# EAGLE design CAN Bus Breakout V1.0 (EAGLE 7.5.0)
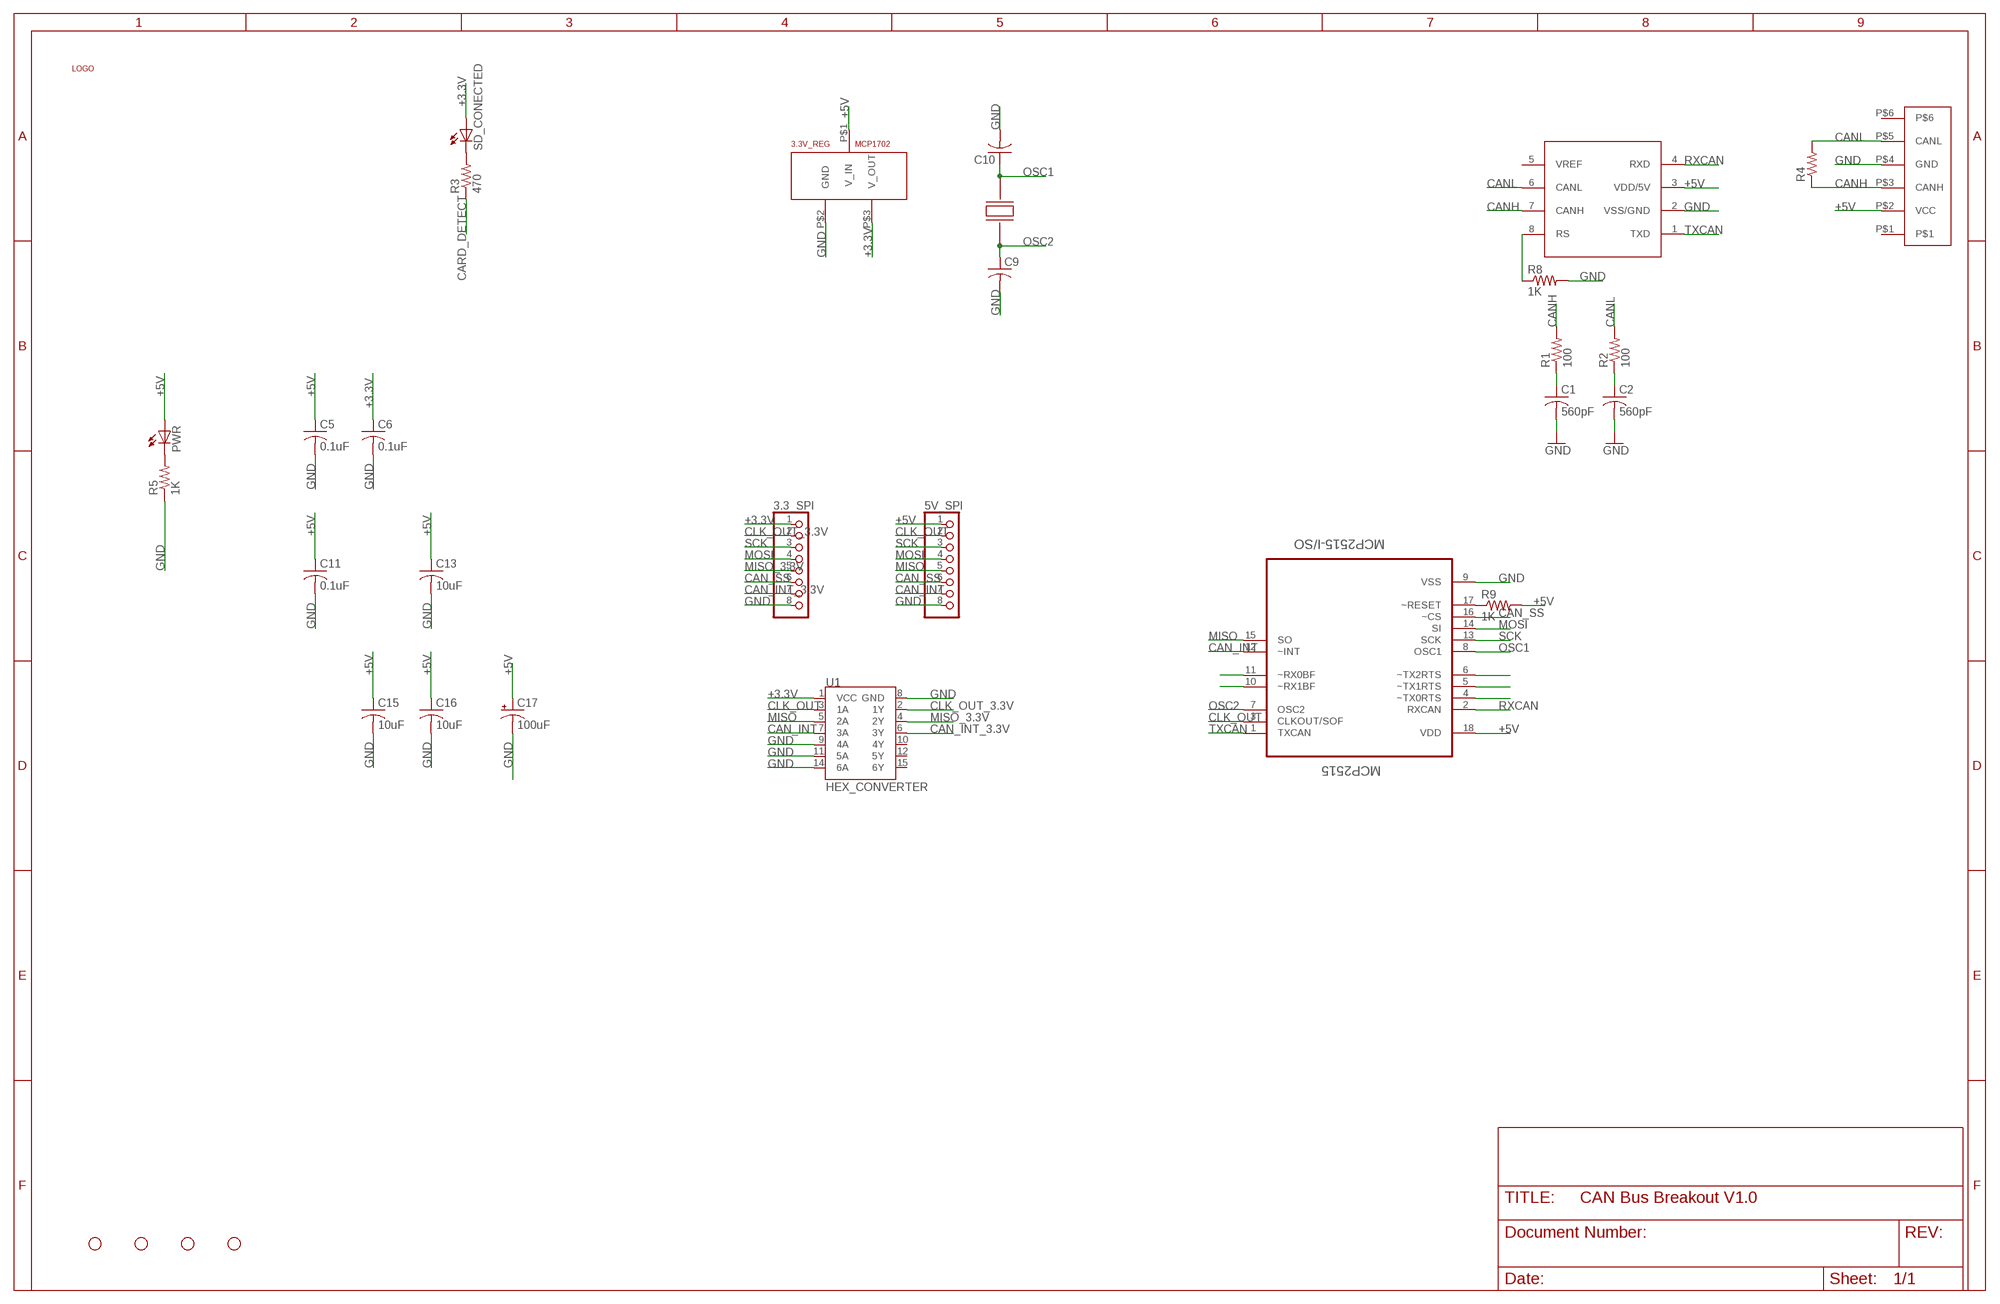
[diagram p0: schematic, sheet 1]

## Parts
3.3_SPI  PINHD-1X8CLEANBIG  [1X08-CLEANBIG]
3.3V_REG  MCP1702  [SOT-23A]
5V_SPI  PINHD-1X8CLEANBIG  [1X08-CLEANBIG]
C1  560pF  C-USC0805  [C0805]
C2  560pF  C-USC0805  [C0805]
C5  0.1uF  C-USC0805  [C0805]
C6  0.1uF  C-USC0805  [C0805]
C9  C-USC0805  [C0805]
C10  C-USC0805  [C0805]
C11  0.1uF  C-USC0805  [C0805]
C13  10uF  C-USC0805  [C0805]
C15  10uF  C-USC0805  [C0805]
C16  10uF  C-USC0805  [C0805]
C17  100uF  47UF-50V-20%(ELECT)  [PANASONIC_D]
MCP2515  MCP2515-I/SO  [SOIC127P1034X264-18N]
PWR  LED1206  [LED-1206]
R1  100  R-US_M0805  [M0805]
R2  100  R-US_M0805  [M0805]
R3  470  R-US_M0805  [M0805]
R4  R-US_M0805  [M0805]
R5  1K  R-US_M0805  [M0805]
R8  1K  R-US_M0805  [M0805]
R9  1K  R-US_M0805  [M0805]
SD_CONECTED  LED1206  [LED-1206]
STANDOFF1  STAND-OFF  [STAND-OFF]
STANDOFF2  STAND-OFF  [STAND-OFF]
STANDOFF3  STAND-OFF  [STAND-OFF]
STANDOFF4  STAND-OFF  [STAND-OFF]
U1  HEX_CONVERTER  [SO016]
U$1  CAN_6P6C  [CAN_6P6C]
U$2  MCP2551DIP  [DIP8]
U$3  LOGO  [LOGO]
U$19  CRYSTAL  [7A_CRYSTAL]

## Nets
+3.3V: 3.3_SPI.1 3.3V_REG.P$3(V_OUT) C6.1 SD_CONECTED.A U1.1(VCC)
+5V: 3.3V_REG.P$1(V_IN) 5V_SPI.1 C5.1 C11.1 C13.1 C15.1 C16.1 C17.+ MCP2515.18(VDD) PWR.A R9.2 U$1.P$2(VCC) U$2.3(VDD/5V)
CAN_INT: 5V_SPI.7 MCP2515.12(~INT) U1.7(3A)
CAN_INT_3.3V: 3.3_SPI.7 U1.6(3Y)
CAN_SS: 3.3_SPI.6 5V_SPI.6 MCP2515.16(~CS)
CANH: R1.2 R4.1 U$1.P$3(CANH) U$2.7(CANH)
CANL: R2.2 R4.2 U$1.P$5(CANL) U$2.6(CANL)
CARD_DETECT: R3.1
CLK_OUT: 5V_SPI.2 MCP2515.3(CLKOUT/SOF) U1.3(1A)
CLK_OUT_3.3V: 3.3_SPI.2 U1.2(1Y)
GND: 3.3_SPI.8 3.3V_REG.P$2(GND) 5V_SPI.8 C1.2 C2.2 C5.2 C6.2 C9.2 C10.2 C11.2 C13.2 C15.2 C16.2 C17.- MCP2515.9(VSS) R5.1 R8.2 U1.8(GND) U1.9(4A) U1.11(5A) U1.14(6A) U$1.P$4(GND) U$2.2(VSS/GND)
MISO: 5V_SPI.5 MCP2515.15(SO) U1.5(2A)
MISO_3.3V: 3.3_SPI.5 U1.4(2Y)
MOSI: 3.3_SPI.4 5V_SPI.4 MCP2515.14(SI)
N$1: MCP2515.4(~TX0RTS)
N$2: MCP2515.5(~TX1RTS)
N$3: MCP2515.6(~TX2RTS)
N$4: MCP2515.11(~RX0BF)
N$7: R3.2 SD_CONECTED.C
N$12: R8.1 U$2.8(RS)
N$15: MCP2515.17(~RESET) R9.1
N$19: PWR.C R5.2
N$24: MCP2515.10(~RX1BF)
N$25: C1.1 R1.1
N$26: C2.1 R2.1
OSC1: C10.1 MCP2515.8(OSC1) U$19.P$2
OSC2: C9.1 MCP2515.7(OSC2) U$19.P$1
RXCAN: MCP2515.2(RXCAN) U$2.4(RXD)
SCK: 3.3_SPI.3 5V_SPI.3 MCP2515.13(SCK)
TXCAN: MCP2515.1(TXCAN) U$2.1(TXD)
Unconnected: U1.10(4Y) U1.12(5Y) U1.15(6Y) U$1.P$1 U$1.P$6 U$2.5(VREF)

## Library data of the parts
3.3_SPI 5V_SPI = adafruit:PINHD-1X8: PIN HEADER
3.3V_REG = mylibrary:MCP1702
C1 C2 C5 C6 C9-C11 C13 C15 C16 = adafruit:C-US: CAPACITOR, American symbol
C17 = SparkFun-Capacitors:47UF-50V-20%(ELECT): CAP-10547; PROD_ID: CAP-10547
MCP2515 = Microchip_By_element14_Batch_1:MCP2515-I/SO: CAN Controller; MPN: MCP2515-I/SO; OC_FARNELL: 1292239; OC_NEWARK: 29H7136; PACKAGE: SOIC-18; SUPPLIER: Microchip
PWR SD_CONECTED = Shell2013:LED: LEDs Standard schematic elements and footprints for 5mm, 3mm, 1206, and 0603 sized LEDs. 5mm - Spark Fun Electronics SKU : COM-00529 (and others)
R1-R5 R8 R9 = adafruit:R-US_: RESISTOR, American symbol
STANDOFF1-STANDOFF4 = SparkFun-Electromechanical:STAND-OFF: #4 Stand Off This is the mechanical footprint for a #4 phillips button head screw. Use the keepout ring to avoid running the screw head into surrounding components. SKU : PRT-00447
U1 = SparkFun-DigitalIC:HEX_CONVERTER: 74HC4050 Hex Buffer Level Shifter SMD SO016; PROD_ID: IC-09604
U$1 = Shell2013:CAN_6P6C: Digikey part: 553-2258-ND
U$2 = E-P-099-R2.2:MCP2551
U$3 = Shell2015:LOGO
U$19 = mylibrary:CRYSTAL

## Board
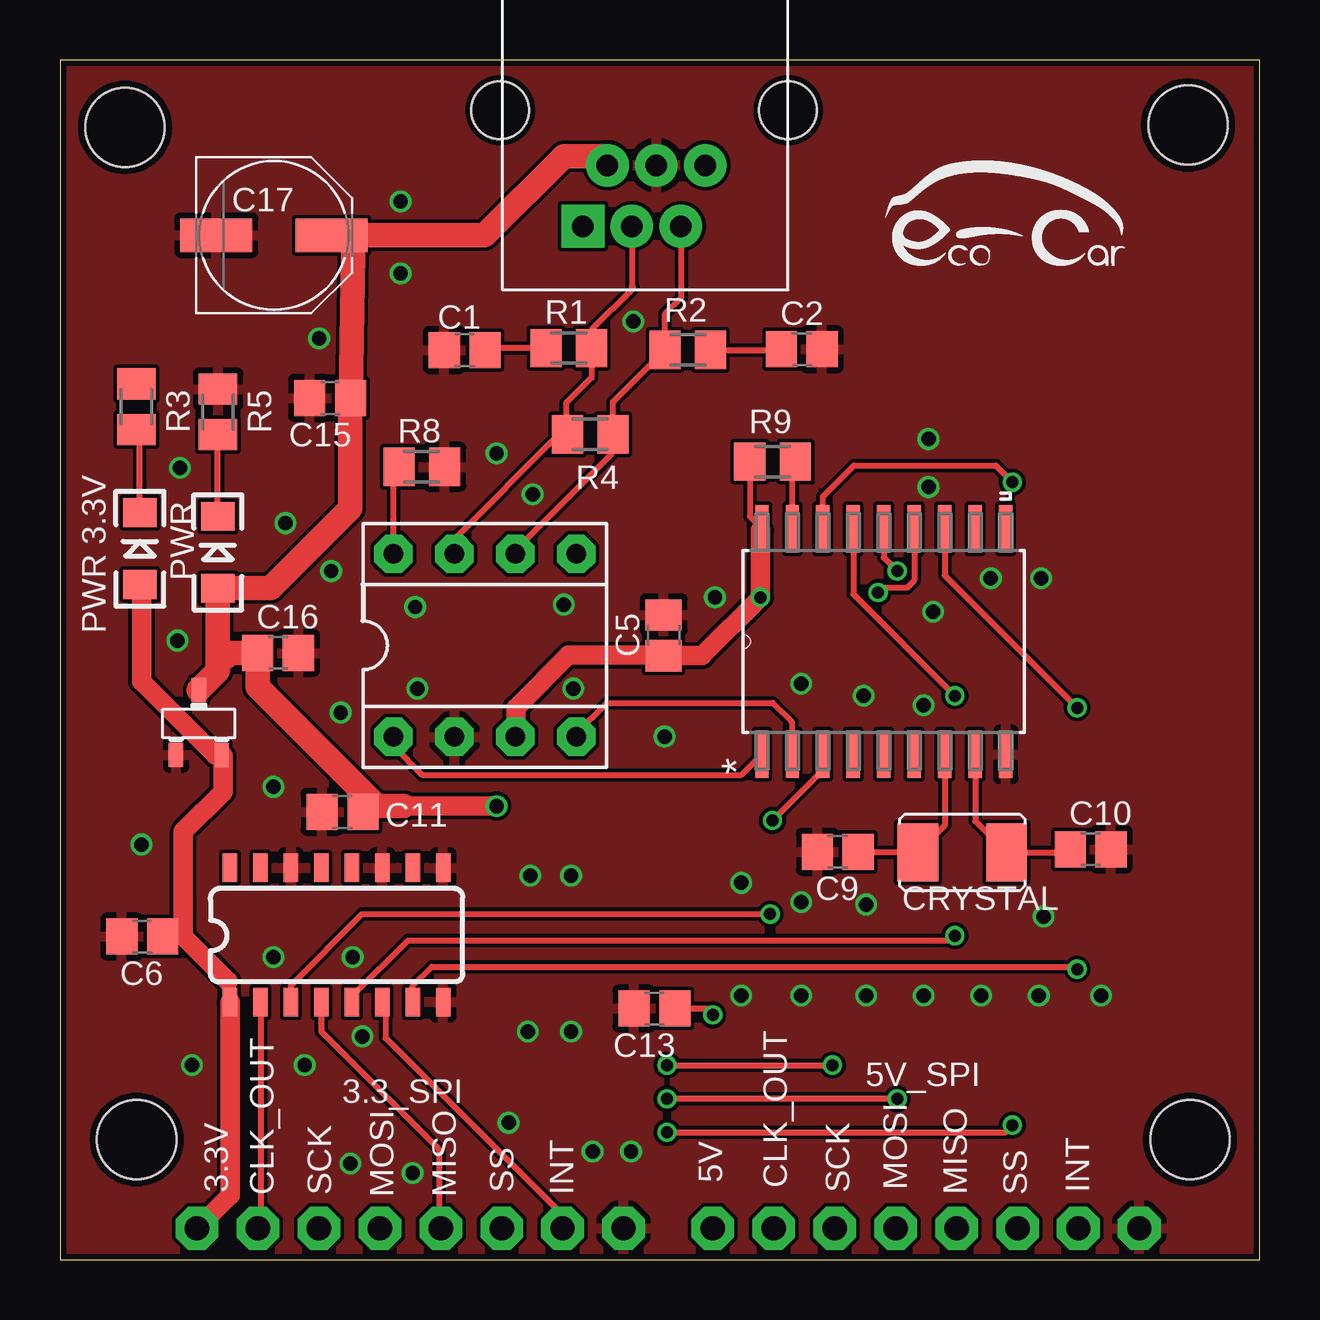
[diagram p1: board, top side]
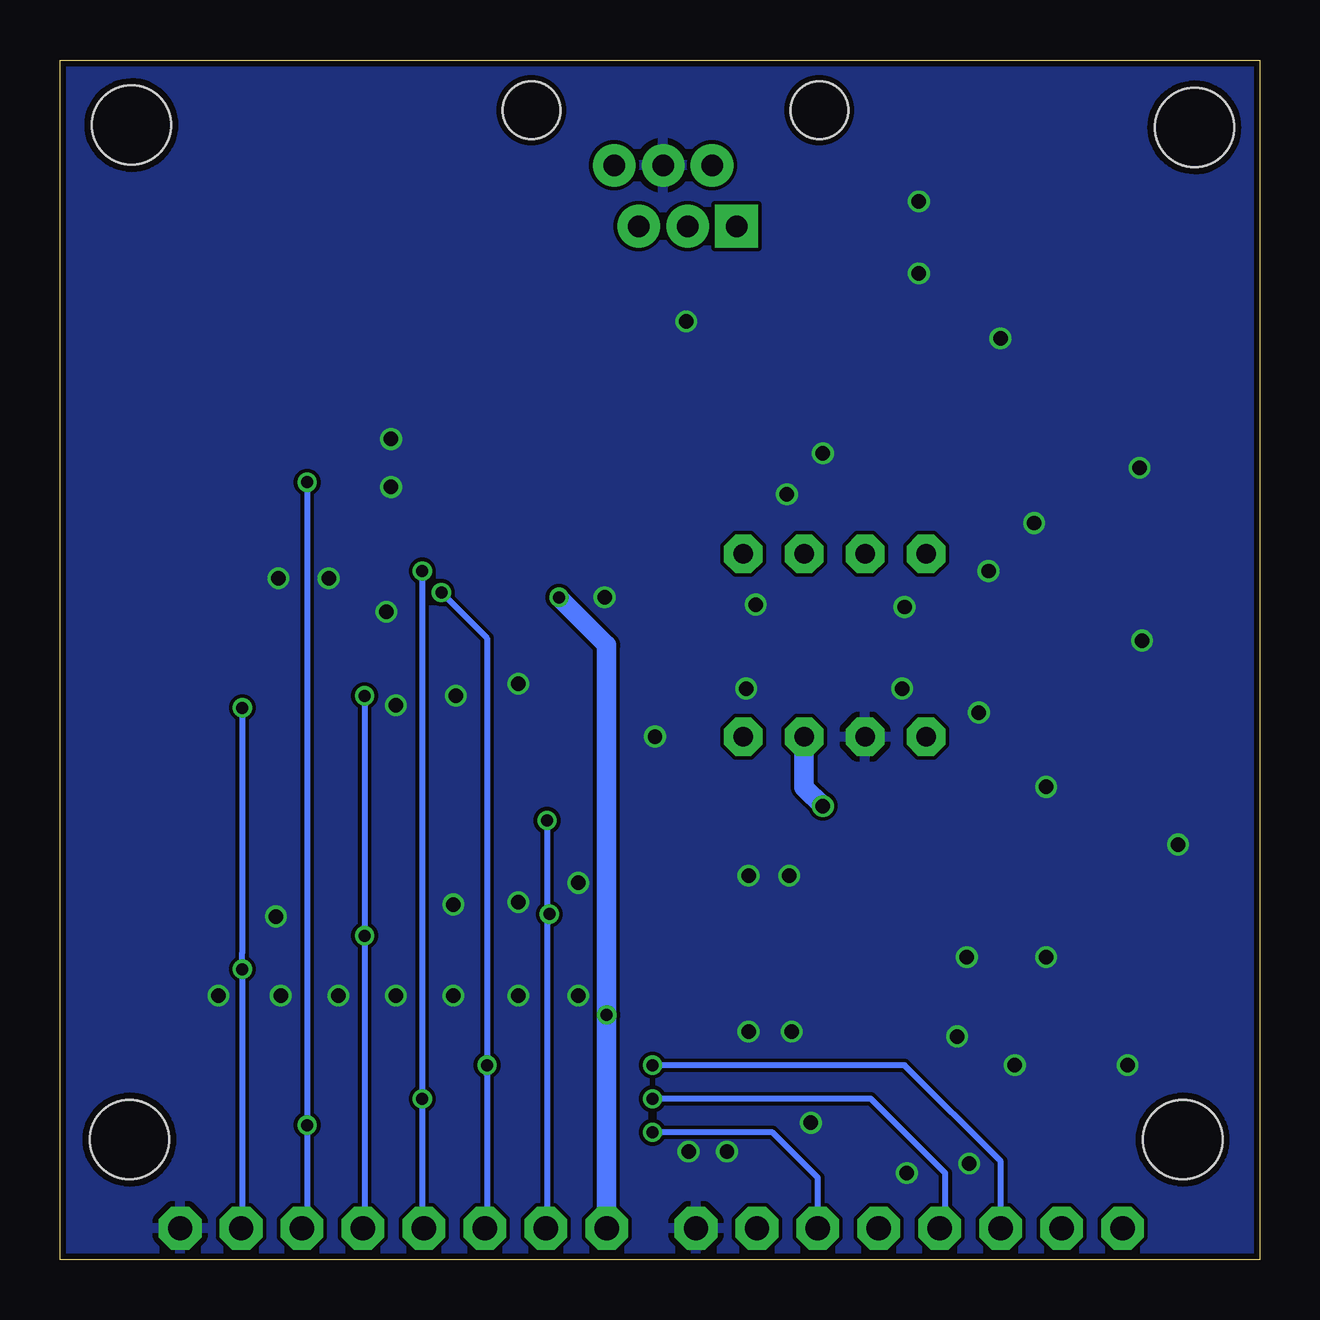
[diagram p2: board, bottom side, seen from below]

Size 50 x 50 mm. Coordinates in mm from the lower left corner, seen from the top.
Outline: 0,0 50,0 50,50 0,50 0,0
Copper layers (1*16): Top 0.035mm / dielectric 1.5mm / Bottom 0.035mm
Design rules "SeeedStudio_2layer_DRU_no_angle_20140221": minimum track width 6mil, minimum drill 12mil, track to track 6mil, track to pad 6mil, pad to pad 6mil, via to via 6mil, smd to smd 0mil, copper to edge 10mil, drill to drill 10mil, minimum pad ring 10mil, minimum via ring 6mil, stop-mask expansion 2mil, vias tented up to drill 100mil, thermal gap 10mil

### Footprints (pad centres in the part's own frame; a part is rotated, then mirrored left to right if it is on the bottom)
1X08-CLEANBIG = drill 1.016 pad 1.778 octagon: 1 -8.89,0; 2 -6.35,0; 3 -3.81,0; 4 -1.27,0; 5 1.27,0; 6 3.81,0; 7 6.35,0; 8 8.89,0
SOT-23A = smd 0.6 x 1: P$1 0,0; P$2 -0.95,-2.7; P$3 0.95,-2.7
C0805 = smd 1.3 x 1.5: 1 -0.85,0; 2 0.85,0
PANASONIC_D = smd 3 x 1.4: + 2.4,0; - -2.4,0
SOIC127P1034X264-18N = smd 1.981 x 0.559: 1 -4.699,5.08; 2 -4.699,3.81; 3 -4.699,2.54; 4 -4.699,1.27; 5 -4.699,0; 6 -4.699,-1.27; 7 -4.699,-2.54; 8 -4.699,-3.81; 9 -4.699,-5.08; 10 4.699,-5.08; 11 4.699,-3.81; 12 4.699,-2.54; 13 4.699,-1.27; 14 4.699,0; 15 4.699,1.27; 16 4.699,2.54; 17 4.699,3.81; 18 4.699,5.08
LED-1206 = smd 1.2 x 1.4: A -1.5,0; C 1.5,0
M0805 = smd 1.3 x 1.6: 1 -0.95,0; 2 0.95,0
STAND-OFF = hole 3.302: 0,0
SO016 = smd 0.6 x 1.2: 1 -4.445,-2.8; 2 -3.175,-2.8; 3 -1.905,-2.8; 4 -0.635,-2.8; 5 0.635,-2.8; 6 1.905,-2.8; 7 3.175,-2.8; 8 4.445,-2.8; 9 4.445,2.8; 10 3.175,2.8; 11 1.905,2.8; 12 0.635,2.8; 13 -0.635,2.8; 14 -1.905,2.8; 15 -3.175,2.8; 16 -4.445,2.8
CAN_6P6C = drill 0.9 pad 1.778 square: P$1 4.08,0 | drill 0.9 pad 1.778: P$2 3.06,-2.54; P$3 2.04,0; P$4 1.02,-2.54; P$5 0,0; P$6 -1.02,-2.54 | hole 2.4: -4.47,-4.84; 7.53,-4.84
DIP8 = drill 0.813 pad 1.6 octagon: 1 1.27,-3.81; 2 3.81,-3.81; 3 6.35,-3.81; 4 8.89,-3.81; 5 8.89,3.81; 6 6.35,3.81; 7 3.81,3.81; 8 1.27,3.81
7A_CRYSTAL = smd 1.7 x 2.4: P$1 -1.85,0; P$2 1.85,0

### Placement (x,y rotation side)
3.3_SPI  14.6,1.3 0 top
3.3V_REG  5.79,23.74 0 top
5V_SPI  36.1,1.3 0 top
C1  16.87,37.91 180 top
C2  30.92,37.94 0 top
C5  25.16,26.02 90 top
C6  3.43,13.46 180 top
C9  32.42,17 180 top
C10  42.96,17.1 0 top
C11  11.78,18.66 180 top
C13  24.78,10.46 180 top
C15  11.26,35.91 180 top
C16  9.09,25.29 0 top
C17  8.92,42.69 0 top
MCP2515  34.34,25.76 90 top
PWR  6.58,29.48 90 top
R1  21.21,37.99 0 top
R2  26.17,37.91 180 top
R3  3.19,35.55 270 top
R4  22.1,34.4 0 top
R5  6.59,35.33 270 top
R8  15.08,33.04 0 top
R9  29.7,33.26 180 top
SD_CONECTED  3.33,29.63 90 top
STANDOFF1  3.2,5 0 top
STANDOFF2  47.02,47.29 0 top
STANDOFF3  47.1,5 0 top
STANDOFF4  2.71,47.19 0 top
U1  11.53,13.53 0 top
U$1  25.88,43.07 180 top
U$2  12.63,25.6 0 top
U$3  39.8,43.2 0 top
U$19  37.61,16.97 0 top

### Tracks (layer width: path | path; a pad name or v marks a point on that pad's centre or on a via)
+3.3V
  Top 0.254: C6.1 5.14,13.46 | 7,11.6 7,10.81 U1.1 | 6.8,20.98 3.3V_REG.P$3 6.46,21.04 | 3.4,28.06 SD_CONECTED.A
  Top 0.813: 7,11.6 5.14,13.46 5.14,17.84 6.8,19.5 6.8,20.98 | U1.1 7.08,2.67 3.3_SPI.1 | 6.46,21.04 3.4,24.1 3.4,28.06
+5V  (via drill 0.5, 0.6)
  Top 0.254: R9.2 28.75,30.97 MCP2515.18 29.2,30.4 | C13.1 26.95,10.46 v27.21,10.2 | 6.58,24.8 6.58,24.53 | 14.33,18.9 C11.1 | 25.13,25.2 C5.1 | C15.1 | 12.21,41.9 C17.+ | 22.81,46 U$1.P$2 | 19,21.81 U$2.3
  Top 0.813: 29.2,30.4 v29.2,27.6 26.77,25.17 C5.1 | 25.13,25.2 21.2,25.2 19,23 19,21.81 | v18.2,18.9 14.33,18.9
  Top 1.016: 6.58,24.53 3.3V_REG.P$1 | 14.33,18.9 13.2,18.9 8.24,23.86 C16.1 7.07,25.29 6.58,24.8 PWR.A 8.78,27.98 12.1,31.3 C15.1 | C15.1 12.21,41.9 | C17.+ 17.69,42.69 21,46 22.81,46
  Bottom 0.813: 5V_SPI.1 v27.21,10.2 27.21,25.61 v29.2,27.6 | U$2.3 18.98,19.68 v18.2,18.9
CAN_INT  (via drill 0.5)
  Top 0.254: MCP2515.12 36.88,28.52 v42.4,23 | U1.7 14.71,11.4 15.5,12.2 42.3,12.2 v42.4,12.1
  Bottom 0.254: v42.4,23 42.4,12.8 v42.4,12.1 42.4,1.35 5V_SPI.7
CAN_INT_3.3V
  Top 0.254: U1.6 13.57,10.73 13.57,9.23 21,1.8 21,1.35 3.3_SPI.7 20.9,1.35
CAN_SS  (via drill 0.5)
  Top 0.254: MCP2515.16 31.8,31.8 33.1,33.1 39,33.1 v39.7,32.4 | v25.3,5.3 39.4,5.3 v39.7,5.6
  Bottom 0.254: v39.7,32.4 v39.7,5.6 39.7,1.51 5V_SPI.6 | 3.3_SPI.6 18.41,3.41 20.3,5.3 v25.3,5.3
CANH
  Top 0.254: 23.9,40.5 22.16,38.76 R1.2 22.16,36.76 21.1,35.7 21.1,34.45 R4.1 20.8,34.4 16.4,30 16.4,29.45 U$2.7 | 23.9,40.5 23.84,40.5 | U$1.P$3 23.84,40.56 23.9,40.5
CANL
  Top 0.254: U$2.6 18.98,29.58 23,33.6 23,34.35 R4.2 23.05,35.74 R2.2 25.22,39.42 25.9,40.1 25.9,43.05 U$1.P$5
CLK_OUT  (via drill 0.5)
  Top 0.254: MCP2515.3 31.8,20.4 v29.7,18.3 | U1.3 9.62,11.43 12.6,14.4 v29.6,14.4 29.7,14.3
  Bottom 0.254: v29.7,18.3 29.7,14.3 | 29.7,14.3 29.7,1.35 5V_SPI.2 | v29.6,14.4 29.7,14.3
CLK_OUT_3.3V
  Top 0.254: U1.2 8.36,1.41 3.3_SPI.2
GND  (via drill 0.6)
  other vias: 22.2,4.5 23.8,4.5 21.3,9.5 19.5,9.5 21.3,16 19.6,16 10.2,8.1 12.2,12.6 33.6,11 30.9,11 28.4,11 36,11 38.4,11 40.8,11 43.4,11 18.7,5.7 14.7,3.6 12.1,4 23.9,39.1 8.9,12.6 28.4,15.7 30.9,14.9 33.6,14.8 41,14.3 5.5,8.1 8.9,19.7 3.4,17.3 11.7,22.8 4.9,25.8 25.2,21.8 33.5,23.5 36.4,27 36,23.1 30.9,24 38.8,28.4 36.2,32.2 27.3,27.6 21,27.3 19.7,31.9 18.2,33.6 11.3,28.7 9.4,30.7 5,33 14.8,27.2 14.9,23.8 21.4,23.8 36.2,34.2 40.9,28.4 14.2,41.1 14.2,44.1 10.8,38.4 12.6,9.3
  pour Bottom: -0.1,50.1 50.4,50.1 50.1,-0.1 0,-0.2
  pour Top: -0.1,50.1 50.4,50.1 50.2,-0.2 -0.1,-0.2
MISO  (via drill 0.5)
  Top 0.254: MCP2515.15 33.07,27.73 v37.3,23.5 | U1.5 12.16,10.96 14.5,13.3 37.1,13.3 v37.3,13.5
  Bottom 0.254: v37.3,23.5 37.3,13.9 v37.3,13.5 37.3,1.37 5V_SPI.5
MISO_3.3V
  Top 0.254: U1.4 10.89,9.51 15.8,4.6 15.8,1.37 3.3_SPI.5
MOSI  (via drill 0.5)
  Top 0.254: MCP2515.14 34.34,29.26 v34.9,28.7 | v34.9,6.7 v25.3,6.7
  Bottom 0.254: v34.9,28.7 34.9,8.2 v34.9,6.7 34.9,1.37 5V_SPI.4 | 3.3_SPI.4 13.2,1.3 13.1,1.4 13.1,3.6 16.2,6.7 v25.3,6.7
N$7
  Top 0.254: SD_CONECTED.C 3.33,34.46 R3.2
N$12
  Top 0.254: U$2.8 13.9,32.81 R8.1
N$15
  Top 0.254: MCP2515.17 30.53,33.14 R9.1
N$19
  Top 0.254: PWR.C R5.2
N$25
  Top 0.254: R1.1 17.8,37.99 C1.1
N$26
  Top 0.254: R2.1 30.04,37.91 C2.1
OSC1
  Top 0.254: MCP2515.8 38.15,18.28 U$19.P$2 41.98,16.97 C10.1
OSC2
  Top 0.254: MCP2515.7 36.88,18.09 U$19.P$1 33.3,16.97 C9.1
RXCAN
  Top 0.254: U$2.4 21.52,21.92 22.8,23.2 29.7,23.2 30.5,22.4 30.5,21.09 MCP2515.2
SCK  (via drill 0.5)
  Top 0.254: MCP2515.13 35.61,28.31 35.3,28 34.3,28 v34.1,27.8 | v25.3,8.1 v32.2,8.1
  Bottom 0.254: v34.1,27.8 32.2,25.9 v32.2,8.1 32.2,7.7 32.2,1.39 5V_SPI.3 | 3.3_SPI.3 10.79,4.09 14.8,8.1 v25.3,8.1
TXCAN
  Top 0.254: U$2.1 13.9,21.4 15.1,20.2 28.4,20.2 MCP2515.1

### Text on the board
tPlace: PWR 3.3V | 3.3V | CLK_OUT | SCK | MOSI | MISO | SS | INT | 5V | CLK_OUT | SCK | MOSI | MISO | SS | INT